# EasyEDA Pro project ProPrj_FOC_AT32F413.epro, schematic schematic1_2

## Sheets
1 CORE: Create Date: 2023-11-03; Page Name: CORE; Project Name: 基于AT32F413 的FOC驱动器; Schematic Name: Schematic1_2; Update Date: 2023-11-04; Company: 嘉立创EDA; Page Size: A3; Version: V1.3
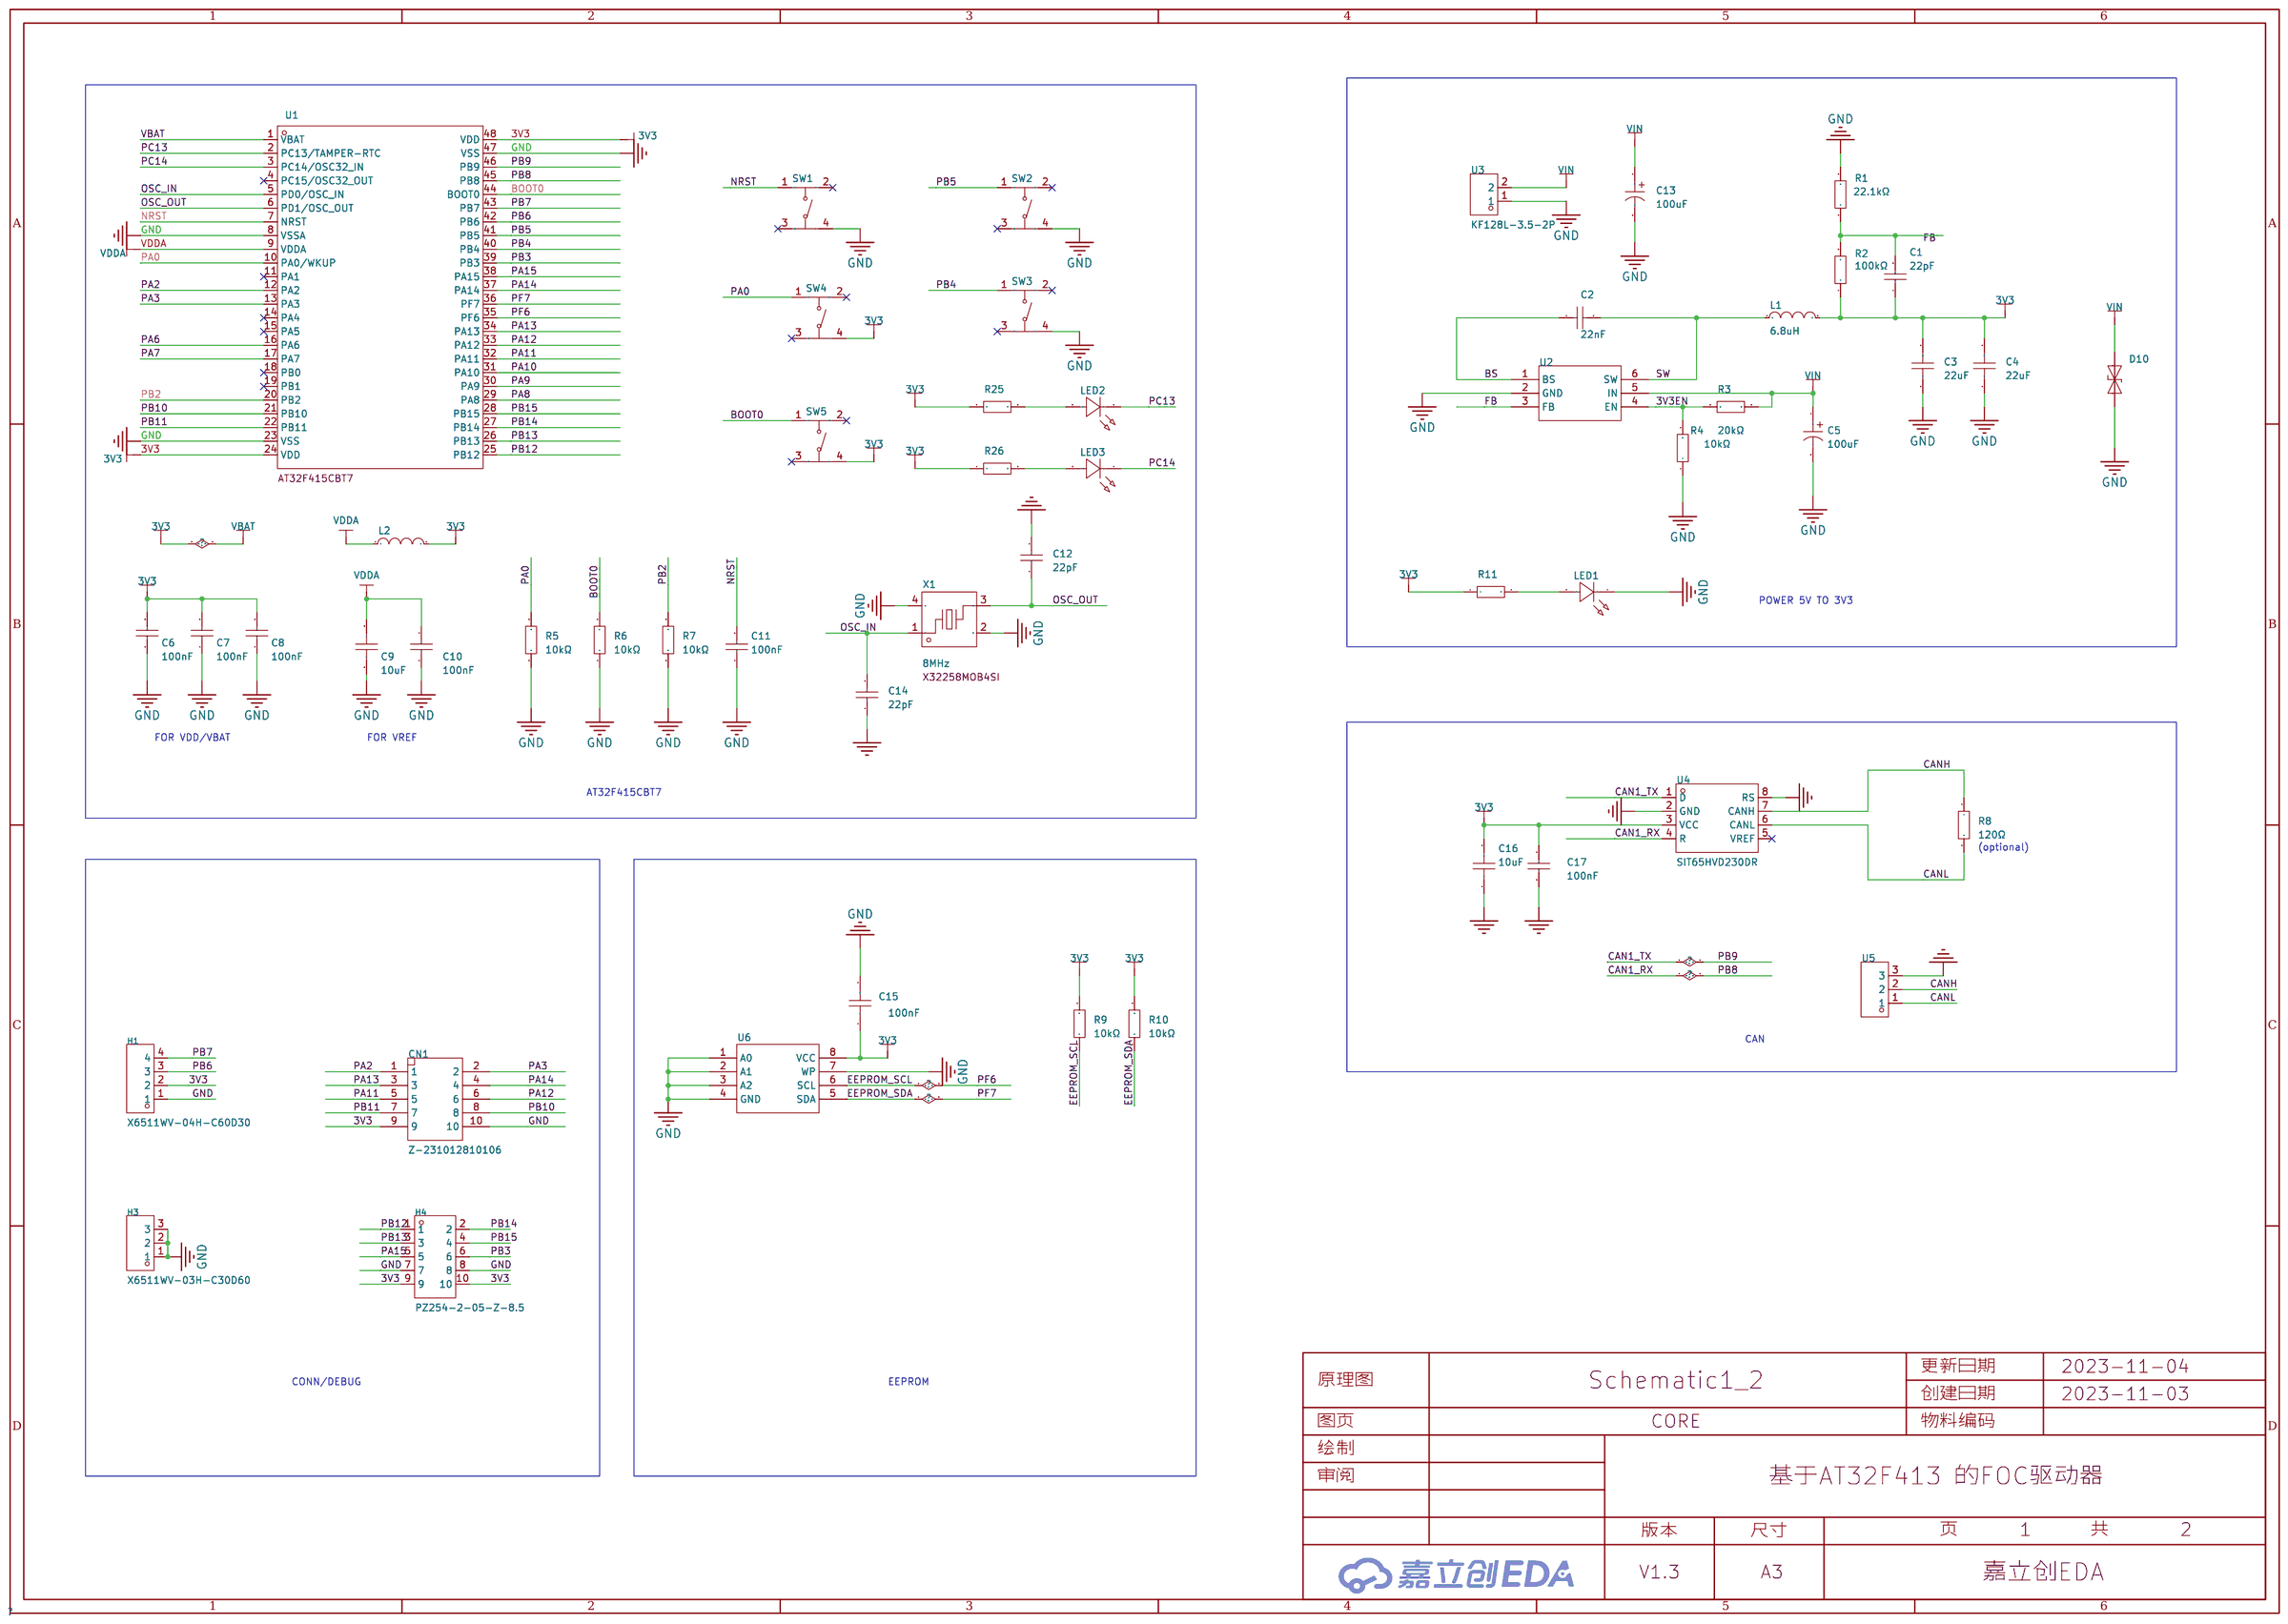
[diagram p4: CORE]
2 DRIVER: Page Name: DRIVER; Version: V1.0
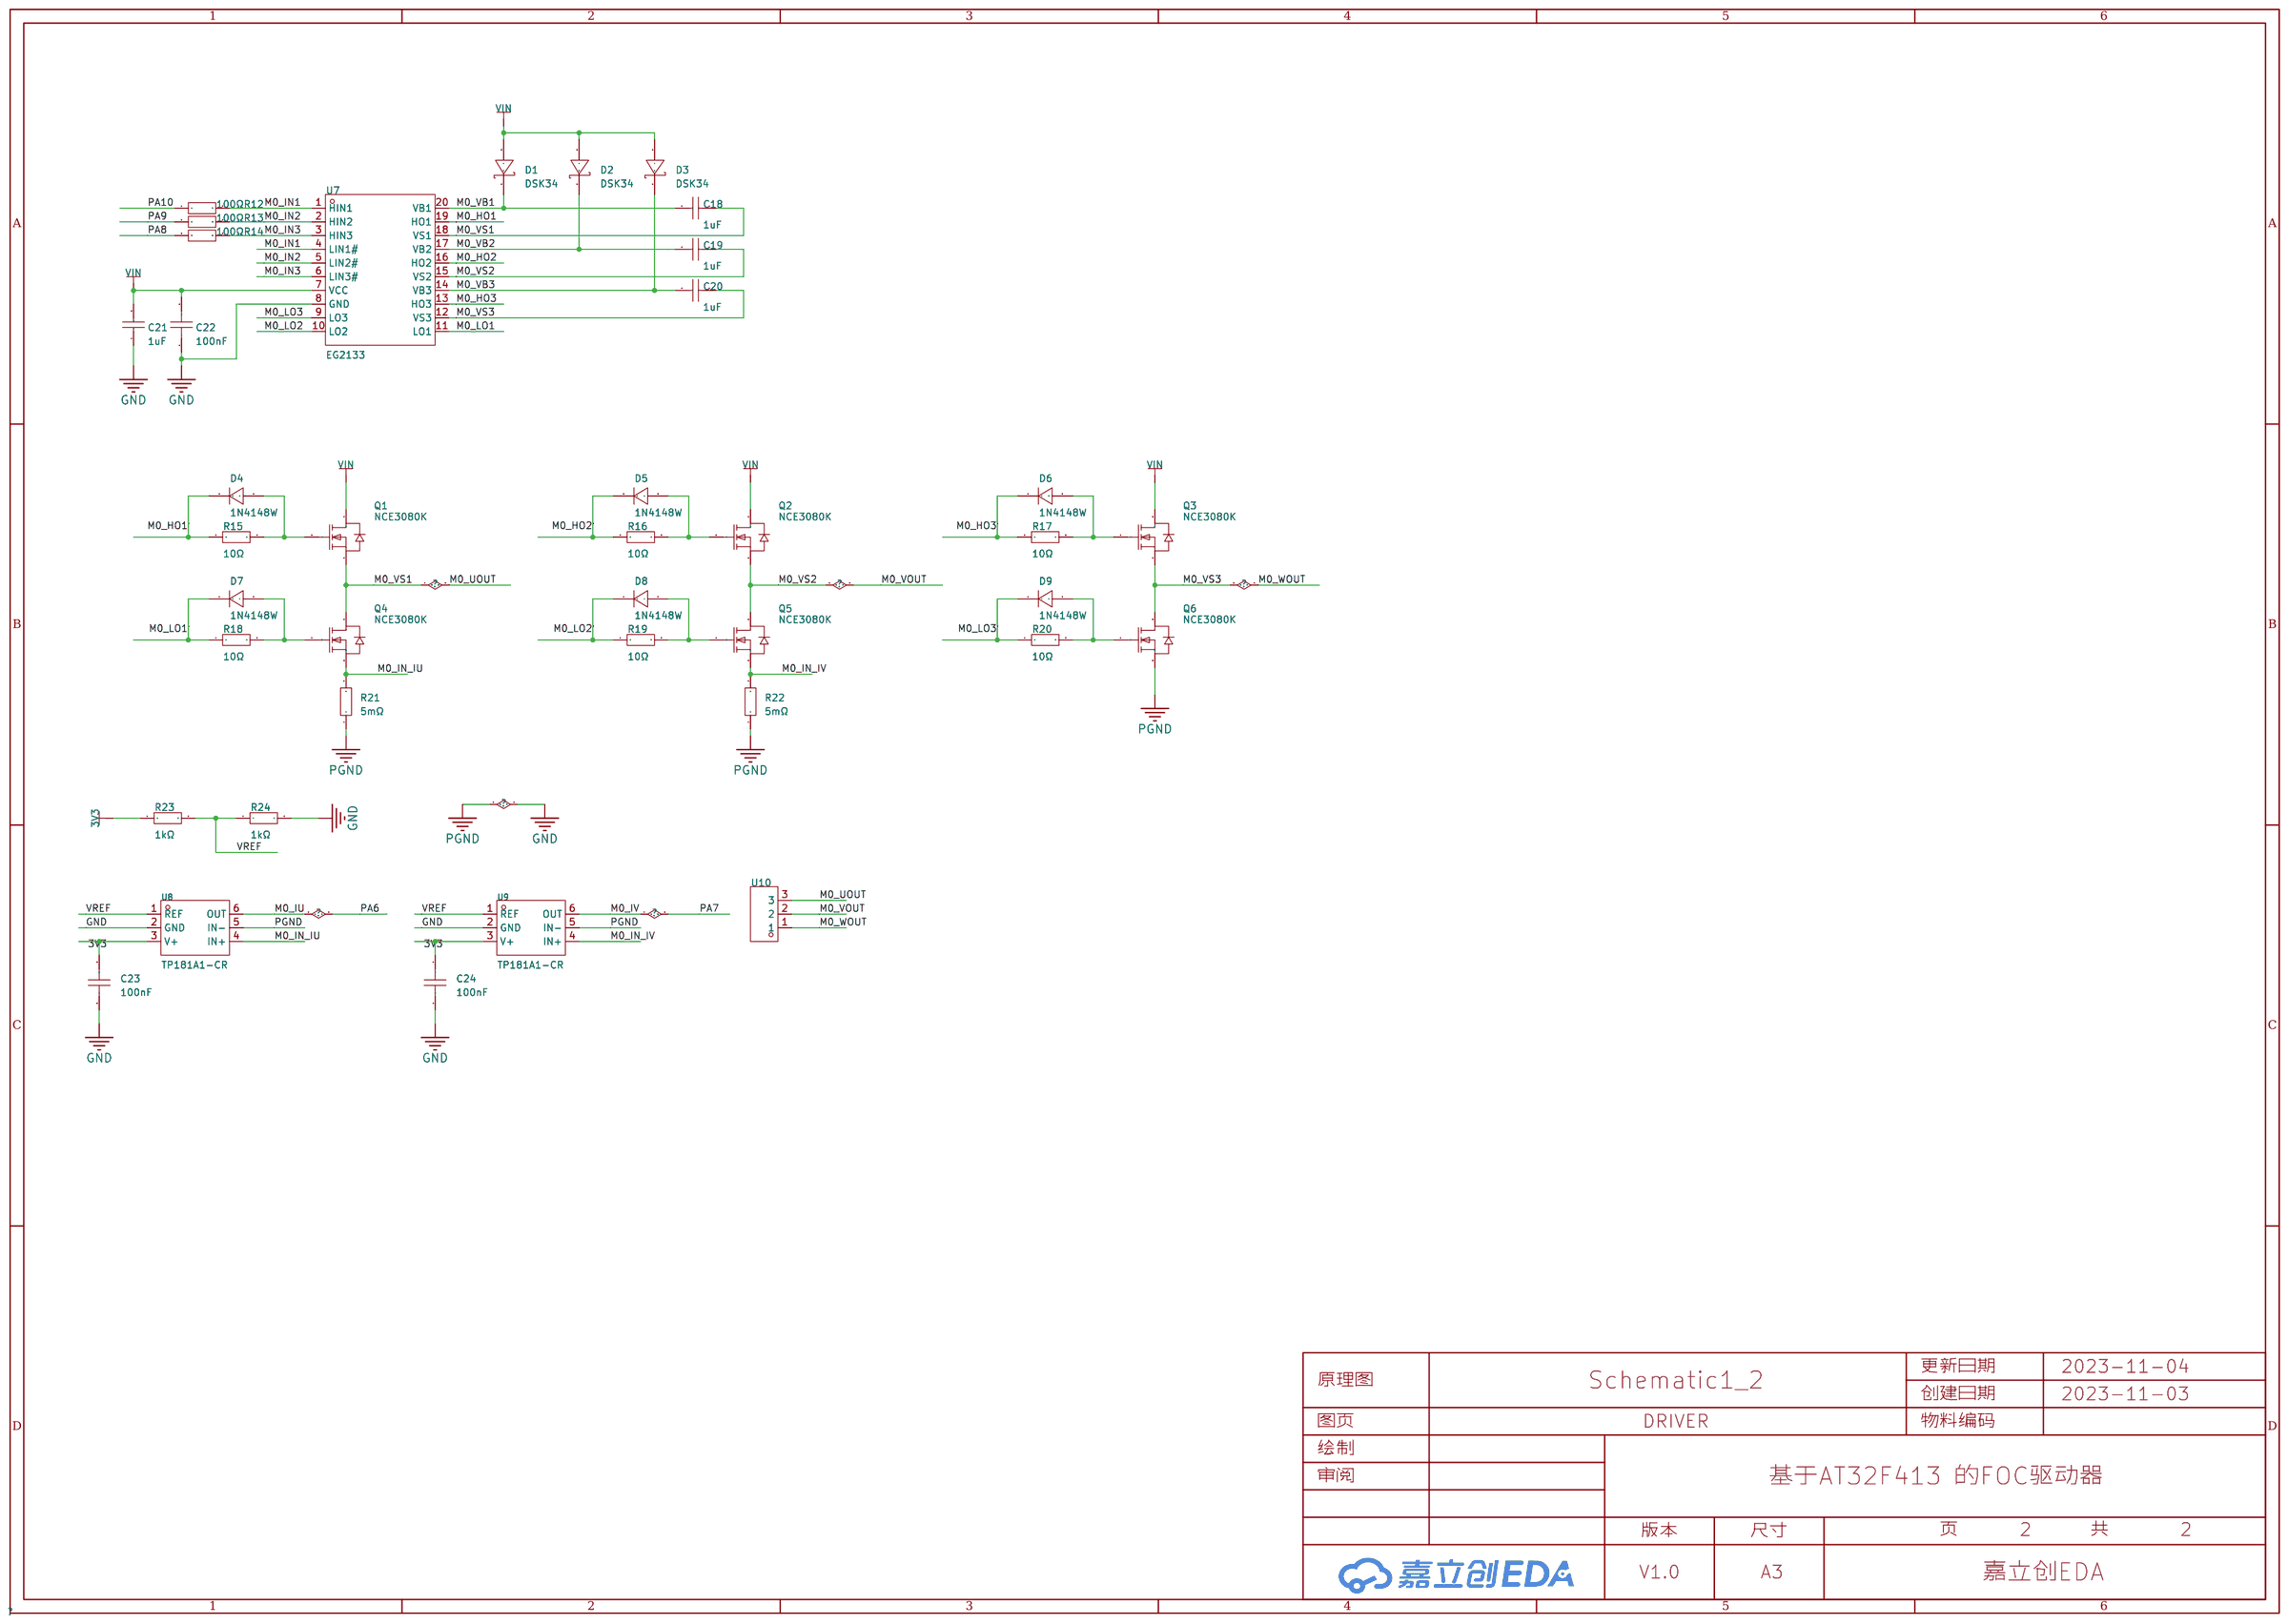
[diagram p5: DRIVER]

## Parts
sheet CORE
C1  22pF  [C0603]
C2  22nF  [C0603]
C3  22uF  [C0805]
C4  22uF  [C0805]
C5  100uF  [CAP-SMD_BD6.3-L6.6-W6.6-LS7.2-FD]
C6  100nF  [C0603]
C7  100nF  [C0603]
C8  100nF  [C0603]
C9  10uF  [C0603]
C10  100nF  [C0603]
C11  100nF  [C0603]
C12  22pF  [C0603]
C13  100uF  [CAP-SMD_BD6.3-L6.6-W6.6-LS7.2-FD]
C14  22pF  [C0603]
C15  100nF  [C0603]
C16  10uF  [C0603]
C17  100nF  [C0603]
CN1  Z-231012810106  [IDC-TH_Z-231012810106]
D10  SMAJ12CA/TR13  [SMA_L4.4-W2.6-LS5.0-BI]
H1  X6511WV-04H-C60D30  [HDR-TH_4P-P2.54-V-M]
H3  X6511WV-03H-C30D60  [HDR-TH_3P-P2.54-V-M]
H4  PZ254-2-05-Z-8.5  [HDR-TH_10P-P2.54-V-M-R2-C5-S2.54]
L1  6.8uH  [IND-SMD_L7.1-W6.6]
L2  3.3uH  [L0603]
LED1  XL-1608UBC-04  [LED0603-RD_BLUE]
LED2  XL-1608UBC-04  [LED0603-RD_BLUE]
LED3  XL-1608UBC-04  [LED0603-RD_BLUE]
R1  22.1kΩ  [R0603]
R2  100kΩ  [R0603]
R3  20kΩ  [R0603]
R4  10kΩ  [R0603]
R5  10kΩ  [R0603]
R6  10kΩ  [R0603]
R7  10kΩ  [R0603]
R8  120Ω  [R0603]
R9  10kΩ  [R0603]
R10  10kΩ  [R0603]
R11  5.1kΩ  [R0603]
R25  5.1kΩ  [R0603]
R26  5.1kΩ  [R0603]
SW1  TS-1145A-B-A  [SW-SMD_4P-L4.2-W3.2-P2.15-LS5.2]
SW2  TS-1145A-B-A  [SW-SMD_4P-L4.2-W3.2-P2.15-LS5.2]
SW3  TS-1145A-B-A  [SW-SMD_4P-L4.2-W3.2-P2.15-LS5.2]
SW4  TS-1145A-B-A  [SW-SMD_4P-L4.2-W3.2-P2.15-LS5.2]
SW5  TS-1145A-B-A  [SW-SMD_4P-L4.2-W3.2-P2.15-LS5.2]
U1  AT32F415CBT7  [LQFP-48_L7.0-W7.0-P0.50-LS9.0-BL]
U2  MT2492  [SOT-23-6_L2.9-W1.6-P0.95-LS2.8-BL]
U3  KF128L-3.5-2P  [CONN-TH_P3.50_KF128L-3.5-2P]
U4  SIT65HVD230DR  [SOP-8_L4.9-W3.9-P1.27-LS6.0-BL]
U5  KF128L-3.5-3P  [CONN-TH_3P-P3.50_KF128L-3.5-3P]
U6  AT24C02C-SSHM-T  [SOIC-8_L5.0-W4.0-P1.27-LS6.0-BL]
X1  8MHz  [OSC-SMD_4P-L3.2-W2.5-BL]
sheet DRIVER
C18  1uF  [C0603]
C19  1uF  [C0603]
C20  1uF  [C0603]
C21  1uF  [C0603]
C22  100nF  [C0603]
C23  100nF  [C0603]
C24  100nF  [C0603]
D1  DSK34  [SOD-123_L2.8-W1.8-LS3.7-RD]
D2  DSK34  [SOD-123_L2.8-W1.8-LS3.7-RD]
D3  DSK34  [SOD-123_L2.8-W1.8-LS3.7-RD]
D4  1N4148W  [SOD-123F_L2.7-W1.6-LS3.8-RD]
D5  1N4148W  [SOD-123F_L2.7-W1.6-LS3.8-RD]
D6  1N4148W  [SOD-123F_L2.7-W1.6-LS3.8-RD]
D7  1N4148W  [SOD-123F_L2.7-W1.6-LS3.8-RD]
D8  1N4148W  [SOD-123F_L2.7-W1.6-LS3.8-RD]
D9  1N4148W  [SOD-123F_L2.7-W1.6-LS3.8-RD]
Q1  NCE3080K  [TO-252-2_L6.6-W6.1-P4.57-LS9.9-TL-CW]
Q2  NCE3080K  [TO-252-2_L6.6-W6.1-P4.57-LS9.9-TL-CW]
Q3  NCE3080K  [TO-252-2_L6.6-W6.1-P4.57-LS9.9-TL-CW]
Q4  NCE3080K  [TO-252-2_L6.6-W6.1-P4.57-LS9.9-TL-CW]
Q5  NCE3080K  [TO-252-2_L6.6-W6.1-P4.57-LS9.9-TL-CW]
Q6  NCE3080K  [TO-252-2_L6.6-W6.1-P4.57-LS9.9-TL-CW]
R12  100Ω  [R0603]
R13  100Ω  [R0603]
R14  100Ω  [R0603]
R15  10Ω  [R0805_NEW]
R16  10Ω  [R0805_NEW]
R17  10Ω  [R0805_NEW]
R18  10Ω  [R0805_NEW]
R19  10Ω  [R0805_NEW]
R20  10Ω  [R0805_NEW]
R21  5mΩ  [RES-SMD_L6.4-W3.2-1]
R22  5mΩ  [RES-SMD_L6.4-W3.2-1]
R23  1kΩ  [R0603]
R24  1kΩ  [R0603]
U7  EG2133  [TSSOP-20_L6.5-W4.4-P0.65-LS6.4-BL]
U8  TP181A1-CR  [SC70-6_L2.1-W1.3-P0.65-LS2.3-BL]
U9  TP181A1-CR  [SC70-6_L2.1-W1.3-P0.65-LS2.3-BL]
U10  KF128L-3.5-3P  [CONN-TH_3P-P3.50_KF128L-3.5-3P]

## Library data of the parts
C1 C12 C14 = CL10C220JB8NNNC: 容值:22pF;精度:±5%;额定电压:50V;材质(温度系数):C0G;; LCSC Part Name: 22pF ±5% 50V; Supplier Part: C1653; Manufacturer: SAMSUNG(三星); Supplier Footprint: 0603; JLCPCB Part Class: Basic Part; Datasheet: https://atta.szlcsc.com/upload/public/pdf/source/20160103/1457707687317.pdf; Supplier: LCSC; Tolerance: ±5%; Voltage Rated: 50V; Temperature Coefficient: C0G
C2 = CL10B223KB8NNNC: 容值:22nF;精度:±10%;额定电压:50V;材质(温度系数):X7R;; LCSC Part Name: 22nF ±10% 50V; Supplier Part: C21122; Manufacturer: SAMSUNG(三星); Supplier Footprint: 0603; JLCPCB Part Class: Basic Part; Datasheet: https://atta.szlcsc.com/upload/public/pdf/source/20160103/1457707705232.pdf; Supplier: LCSC; Tolerance: ±10%; Voltage Rated: 50V; Temperature Coefficient: X7R
C3 C4 = CL21A226MAQNNNE_C45783: 容值:22uF;精度:±20%;额定电压:25V;材质(温度系数):X5R;; LCSC Part Name: 22uF ±20% 25V; Supplier Part: C45783; Manufacturer: SAMSUNG(三星); Manufacturer Part: CL21A226MAQNNNE; Supplier Footprint: 0805; JLCPCB Part Class: 基础库; Datasheet: https://atta.szlcsc.com/upload/public/pdf/source/20160103/1457707727161.pdf; Supplier: LCSC; Tolerance: ±20%; Voltage Rated: 25V; Temperature Coefficient: X5R
C5 C13 = PM101M025E077PTR: 容值:100uF;精度:±20%;额定电压:25V;; LCSC Part Name: 100uF ±20% 25V; Supplier Part: C2858382; Manufacturer: CapXon(丰宾); Supplier Footprint: SMD,6.3x7.7mm; JLCPCB Part Class: 扩展库; Datasheet: https://atta.szlcsc.com/upload/public/pdf/source/20210804/C2858382_57ECED37ED638FF3D71FBD68EF7F0C39.pdf; Supplier: LCSC; Tolerance: ±20%; Rated Voltage: 25V
C6-C8 C10 C11 C17 = 0603B104K500NT: 容值:100nF;精度:±10%;额定电压:50V;材质(温度系数):X7R;; LCSC Part Name: 100nF ±10% 50V; Supplier Part: C30926; Manufacturer: FH(风华); Supplier Footprint: 0603; JLCPCB Part Class: Extended Part; Datasheet: https://atta.szlcsc.com/upload/public/pdf/source/20170923/C30926_1506149436298988724.pdf; Supplier: LCSC; Tolerance: ±10%; Voltage Rated: 50V; Temperature Coefficient: X7R
C9 C16 = CL10A106KP8NNNC: 容值:10uF;精度:±10%;额定电压:10V;材质(温度系数):X5R;; LCSC Part Name: 10uF ±10% 10V; Supplier Part: C19702; Manufacturer: SAMSUNG(三星); Supplier Footprint: 0603; JLCPCB Part Class: Basic Part; Datasheet: https://atta.szlcsc.com/upload/public/pdf/source/20160103/1457707703378.pdf; Supplier: LCSC; Tolerance: ±10%; Voltage Rated: 10V; Temperature Coefficient: X5R
C15 = CC0603KRX7R9BB104: 容值:100nF;精度:±10%;额定电压:50V;材质(温度系数):X7R;; LCSC Part Name: 100nF ±10% 50V; Supplier Part: C14663; Manufacturer: YAGEO(国巨); Supplier Footprint: 0603; JLCPCB Part Class: Basic Part; Datasheet: https://atta.szlcsc.com/upload/public/pdf/source/20180910/C282072_33301C7F631E79921B82A8DAC6BCC5B3.pdf; Supplier: LCSC; Tolerance: ±10%; Voltage Rated: 50V; Temperature Coefficient: X7R
CN1 = Z-231012810106: 连接器类型:简牛座;每排PIN数:5;结构:2x5P;排数:2;间距:2.54mm;行距:2.54mm;封装形式:弯插;触头材质:黄铜;触头镀层:金;; LCSC Part Name: 每排P数:5 2x5P 排数:2 2.54mm; Supplier Part: C93705; Manufacturer: Nextron(正凌); Supplier Footprint: 弯插,P=2.54mm; JLCPCB Part Class: 扩展库; Datasheet: https://atta.szlcsc.com/upload/public/pdf/source/20170614/1497440021778.pdf; Supplier: LCSC; Connector Type: 简牛座; Pin Number in each Row: 5; Structure: 2x5P; Number of Rows: 2; Pitch: 2.54mm; Row Spacing: 2.54mm; Holder Type: 弯插; Contact Material: 黄铜; Contact Plating: 金
D10 = SMAJ12CA/TR13: 极性:双向;反向截止电压(Vrwm):12V;击穿电压(最小值):13.3V;击穿电压(最大值):14.7V;反向漏电流(Ir):1uA;峰值脉冲电流(Ipp)@10/1000s:20.1A;最大钳位电压:19.9V;; LCSC Part Name: 双向 Vrwm:12V; Supplier Part: C78399; Manufacturer: Brightking(君耀电子); Supplier Footprint: SMA(DO-214AC); JLCPCB Part Class: Extended Part; Datasheet: https://atta.szlcsc.com/upload/public/pdf/source/20160709/1468031880937.pdf; Supplier: LCSC; Polarity: 双向; Reverse Stand-Off Voltage (Vrwm): 12V; Breakdown Voltage (Min): 13.3V; Breakdown Voltage (Max): 14.7V; Reverse Leakage Current (Ir): 1uA; Peak Pulse Current (Ipp)@10/1000μs: 20.1A; Maximum Clamping Voltage: 19.9V
H1 = X6511WV-04H-C60D30: 排数:单排;总PIN位数:4P;间距:2.54mm;插针结构:1x4P;行距:-;安装类型:直插;圆针/方针:方针;额定电流:3A;额定电压:250V;配合针长度:6mm;塑高:2.5mm;端接针长度:3mm;触头材质:黄铜;触头镀层:金;工作温度范围:-40℃~+105℃;焊接温度(最大值):260℃;颜色:黑色;; LCSC Part Name: 2.54mm 1x4P 直插 方针 镀金足1U; Supplier Part: C706876; Manufacturer: XKB Connectivity(中国星坤); Supplier Footprint: 插件,P=2.54mm; JLCPCB Part Class: 扩展库; Datasheet: https://atta.szlcsc.com/upload/public/pdf/source/20211009/D19569EFFEB9776B42364DF7D41FD96A.pdf; Supplier: LCSC; Number of Rows: 单排; Number of Pins: 4P; Pitch: 2.54mm; Pin Structure: 1x4P; Mounting Type: 直插; Circluar Pins/Square Pins: 方针; Current Rating (Max): 3A; Voltage Rating (Max): 250V; Length of Mating Pin: 6mm; Insulation Height: 2.5mm; Length of End Connection Pin: 3mm; Contact Material: 黄铜; Contact Plating: 金; Operating Temperature Range: -40℃~+105℃; Welding Temperature (Max): 260℃; Color: 黑色
H3 = X6511WV-03H-C30D60: 排数:单排;总PIN位数:3;间距:2.54mm;插针结构:1x3P;行距:-;安装类型:直插;圆针/方针:方针;额定电流:3A;额定电压:250V;配合针长度:6mm;塑高:2.5mm;端接针长度:3mm;触头材质:黄铜;触头镀层:金;工作温度范围:-40℃~+105℃;焊接温度(最大值):260℃;颜色:黑色;; LCSC Part Name: 2.54mm 1x3P 直插 方针; Supplier Part: C706875; Manufacturer: XKB Connectivity(中国星坤); Supplier Footprint: 插件,P=2.54mm; JLCPCB Part Class: Extended Part; Supplier: LCSC; Number of Rows: 单排; Number of Pins: 3; Pitch: 2.54mm; Pin Structure: 1x3P; Mounting Type: 直插; Circluar Pins/Square Pins: 方针; Current Rating (Max): 3A; Voltage Rating (Max): 250V; Length of Mating Pin: 6mm; Insulation Height: 2.5mm; Length of End Connection Pin: 3mm; Contact Material: 黄铜; Contact Plating: 金; Operating Temperature Range: -40℃~+105℃; Welding Temperature (Max): 260℃; Color: 黑色
H4 = PZ254-2-05-Z-8.5_C2894966: 排数:双排;总PIN位数:10;间距:2.54mm;插针结构:2x5P;行距:2.54mm;安装类型:直插;圆针/方针:方针;额定电流:3A;额定电压:-;配合针长度:6mm;塑高:2.5mm;端接针长度:3mm;触头材质:-;工作温度范围:-40℃~+105℃;颜色:黑色;; LCSC Part Name: 2.54mm 2x5P 直插 方针; Supplier Part: C2894966; Manufacturer: HCTL(华灿天禄); Supplier Footprint: 直插,P=2.54mm; JLCPCB Part Class: Extended Part; Supplier: LCSC; Number of Rows: 双排; Number of Pins: 10; Pitch: 2.54mm; Pin Structure: 2x5P; Row Spacing: 2.54mm; Mounting Type: 直插; Circluar Pins/Square Pins: 方针; Current Rating (Max): 3A; Length of Mating Pin: 6mm; Insulation Height: 2.5mm; Length of End Connection Pin: 3mm; Operating Temperature Range: -40℃~+105℃; Color: 黑色
L1 = 0630 6.8uH: Check: false
L2 = CMH160808B3R3MT: 电感值:3.3uH;精度:±20%;额定电流:-;直流电阻(DCR):-;; LCSC Part Name: 3.3uH ±20%; Supplier Part: C394951; Manufacturer: FH(风华); Supplier Footprint: 0603; JLCPCB Part Class: Extended Part; Datasheet: https://atta.szlcsc.com/upload/public/pdf/source/20190710/C394951_71BAFAF5AD49A9E7B15767971135924D.pdf; Supplier: LCSC; Tolerance: ±20%
LED1-LED3 = XL-1608UBC-04: 发光颜色:蓝灯;透镜颜色:无色透明;主波长:460nm~469nm;峰值波长:475nm;色温:-;光通量(25时):-;测试电流:25mA;正向电压(VF):2.9V;发光强度:60mcd;功率:80mW;发光角度:120°;安装方式:正贴;工作温度:-30~+85;; LCSC Part Name: 蓝灯 正贴; Supplier Part: C965807; Manufacturer: XINGLIGHT(成兴光); Supplier Footprint: 0603; JLCPCB Part Class: Extended Part; Datasheet: https://atta.szlcsc.com/upload/public/pdf/source/20201230/C965807_0B1866580FA037C0283EE42D08A2BF0F.pdf; Supplier: LCSC; Emitted Color: 蓝灯; Lens Color: 无色透明; Dominant Wavelength: 460nm~469nm; Peak Wavelength: 475nm; Forward Current: 25mA; Forward Voltage (VF): 2.9V; Luminous Intensity: 60mcd; Power Dissipation: 80mW; Viewing Angle: 120°; Mounting Sytle: 正贴; Operating Temperature: -30~+85
R1 = 0603WAF2212T5E: 电阻类型:厚膜电阻;阻值:22.1kΩ;精度:±1%;功率:100mW;; LCSC Part Name: 22.1kΩ ±1% 100mW; Supplier Part: C25961; Manufacturer: UNI-ROYAL(厚声); Supplier Footprint: 0603; JLCPCB Part Class: Extended Part; Datasheet: https://atta.szlcsc.com/upload/public/pdf/source/20200306/C422600_1E6D84923E4A46A82E41ADD87F860B5C.pdf; Supplier: LCSC; Temperature Coefficient: ±100ppm/℃; Operating Temperature Range: -55℃~+155℃; Type: 厚膜电阻; Tolerance: ±1%; Power(Watts): 100mW; Overload Voltage (Max): 75V
R2 = 0603WAF1003T5E: 电阻类型:厚膜电阻;阻值:100kΩ;精度:±1%;功率:100mW;温度系数:±100ppm/℃;最大工作电压:75V;工作温度范围:-55℃~+155℃;; LCSC Part Name: 100kΩ ±1% 100mW; Supplier Part: C25803; Manufacturer: UNI-ROYAL(厚声); Supplier Footprint: 0603; JLCPCB Part Class: Basic Part; Datasheet: https://atta.szlcsc.com/upload/public/pdf/source/20200306/C422600_1E6D84923E4A46A82E41ADD87F860B5C.pdf; Supplier: LCSC; Type: 厚膜电阻; Tolerance: ±1%; Power(Watts): 100mW; Temperature Coefficient: ±100ppm/℃; Overload Voltage (Max): 75V; Operating Temperature Range: -55℃~+155℃
R3 = 0603WAF2002T5E: 电阻类型:厚膜电阻;阻值:20kΩ;精度:±1%;功率:100mW;温度系数:±100ppm/℃;最大工作电压:75V;工作温度范围:-55℃~+155℃;; LCSC Part Name: 20kΩ ±1% 100mW; Supplier Part: C4184; Manufacturer: UNI-ROYAL(厚声); Supplier Footprint: 0603; JLCPCB Part Class: Basic Part; Datasheet: https://atta.szlcsc.com/upload/public/pdf/source/20200306/C422600_1E6D84923E4A46A82E41ADD87F860B5C.pdf; Supplier: LCSC; Type: 厚膜电阻; Tolerance: ±1%; Power(Watts): 100mW; Temperature Coefficient: ±100ppm/℃; Overload Voltage (Max): 75V; Operating Temperature Range: -55℃~+155℃
R4 = 0603WAF1002T5E: 电阻类型:厚膜电阻;阻值:10kΩ;精度:±1%;功率:100mW;温度系数:±100ppm/℃;最大工作电压:75V;工作温度范围:-55℃~+155℃;; LCSC Part Name: 10kΩ ±1% 100mW; Supplier Part: C25804; Manufacturer: UNI-ROYAL(厚声); Supplier Footprint: 0603; JLCPCB Part Class: Basic Part; Datasheet: https://atta.szlcsc.com/upload/public/pdf/source/20200306/C422600_1E6D84923E4A46A82E41ADD87F860B5C.pdf; Supplier: LCSC; Type: 厚膜电阻; Tolerance: ±1%; Power(Watts): 100mW; Temperature Coefficient: ±100ppm/℃; Overload Voltage (Max): 75V; Operating Temperature Range: -55℃~+155℃
R5-R7 R9 R10 = 0603WAF1002T5E: 电阻类型:厚膜电阻;阻值:10kΩ;精度:±1%;功率:100mW;; LCSC Part Name: 厚膜电阻 10kΩ ±1% 100mW; Supplier Part: C25804; Manufacturer: UNI-ROYAL(厚声); Supplier Footprint: 0603; JLCPCB Part Class: Basic Part; Datasheet: https://atta.szlcsc.com/upload/public/pdf/source/20200306/C422600_1E6D84923E4A46A82E41ADD87F860B5C.pdf; Supplier: LCSC; Type: 厚膜电阻; Tolerance: ±1%; Power(Watts): 100mW; Temperature Coefficient: ±100ppm/℃; Overload Voltage (Max): 75V; Operating Temperature Range: -55℃~+155℃
R8 = 0603WAF1200T5E: 电阻类型:厚膜电阻;阻值:120Ω;精度:±1%;功率:100mW;; LCSC Part Name: 120Ω ±1% 100mW; Supplier Part: C22787; Manufacturer: UNI-ROYAL(厚声); Supplier Footprint: 0603; JLCPCB Part Class: Basic Part; Datasheet: https://atta.szlcsc.com/upload/public/pdf/source/20200306/C422600_1E6D84923E4A46A82E41ADD87F860B5C.pdf; Supplier: LCSC; Type: 厚膜电阻; Tolerance: ±1%; Power(Watts): 100mW; Temperature Coefficient: ±100ppm/℃; Overload Voltage (Max): 75V; Operating Temperature Range: -55℃~+155℃
R11 R25 R26 = 0603WAF5101T5E: 电阻类型:厚膜电阻;阻值:5.1kΩ;精度:±1%;功率:100mW;温度系数:±100ppm/℃;; LCSC Part Name: 厚膜电阻 5.1kΩ ±1% 100mW; Supplier Part: C23186; Manufacturer: UNI-ROYAL(厚声); Supplier Footprint: 0603; JLCPCB Part Class: Basic Part; Datasheet: https://atta.szlcsc.com/upload/public/pdf/source/20200306/C422600_1E6D84923E4A46A82E41ADD87F860B5C.pdf; Supplier: LCSC; Type: 厚膜电阻; Tolerance: ±1%; Power(Watts): 100mW; Temperature Coefficient: ±100ppm/℃; Overload Voltage (Max): 75V; Operating Temperature Range: -55℃~+155℃
SW1-SW5 = TS-1145A-B-A: 触点电流:50mA;额定电压(DC):12V;绝缘电阻:100mΩ;电路结构:单刀单掷;安装方式:立贴;按钮形状:椭圆形按钮;按钮/盖帽颜色:白色;带灯:无;作用力:260gf;机械寿命:100000;工作温度:-30~+85;开关长度:4.2mm;开关宽度:3.2mm;开关高度:2.5mm;带支架:否;; LCSC Part Name: 3.2X4.2X2.5平脚160gf白色按钮; Supplier Part: C318904; Manufacturer: XKB Connectivity(中国星坤); Supplier Footprint: SMD; JLCPCB Part Class: Extended Part; Datasheet: https://atta.szlcsc.com/upload/public/pdf/source/20211011/FC00869C3CE33BCCD344D072F551E76B.pdf; Supplier: LCSC; Contact Current: 50mA; Voltage Rating (DC): 12V; Insulation Resistance: 100mΩ; Circuit: 单刀单掷; Mounting Style: 立贴; Actuator Style: 椭圆形按钮; Actuator/Cap Color: 白色; With Lamp: 无; Operating Force: 260gf; Mechanical Life: 100000; Operating Temperature: -30~+85; Switch Length: 4.2mm; Switch Width: 3.2mm; Switch Height: 2.5mm; Strike Gundam: 否
U1 = AT32F415CBT7_C528427: CPU内核:ARM Cortex-M4;CPU最大主频:-;程序存储容量:128KB;程序存储器类型:FLASH;RAM总容量:32KB;GPIO端口数量:-;; LCSC Part Name: ARM Cortex-M4; Supplier Part: C528427; Manufacturer: ARTERY(雅特力); Supplier Footprint: LQFP-48(7x7); JLCPCB Part Class: Extended Part; Datasheet: https://atta.szlcsc.com/upload/public/pdf/source/20200507/C528425_955931935851DA1D79A558202FE2F03A.pdf; Supplier: LCSC; CPU Core: ARM Cortex-M4; Program Storage Size: 128KB; Program Memory Type: FLASH; RAM Size: 32KB
U2 = MT2492: 功能类型:降压型;同步整流:-;输出通道数:-;拓扑结构:-;输入电压:-;输出电流(最大值):-;开关频率:-;; LCSC Part Name: 降压型; Supplier Part: C89358; Manufacturer: 西安航天民芯; Supplier Footprint: SOT-23-6; JLCPCB Part Class: Extended Part; Datasheet: https://atta.szlcsc.com/upload/public/pdf/source/20221209/5C81DA9662873D3A116170FFBF63E49D.pdf; Supplier: LCSC; Function: 降压型
U3 = KF128L-3.5-2P: 间距:3.5mm;排数:1;每排PIN数:2;安装方式:直针;额定电流:10A;额定电压:300V;线规 - AWG:16~26;线规 - mm?:1;工作温度范围:-40℃~+105℃;颜色:绿色;; LCSC Part Name: 3.5mm 排数:1 每排P数:2 直针 可拼接 铜 环保; Supplier Part: C474930; Manufacturer: KEFA(科发); Supplier Footprint: 直插,P=3.5mm; JLCPCB Part Class: 扩展库; Datasheet: https://atta.szlcsc.com/upload/public/pdf/source/20200115/C474930_99E88C734F0367C4F80443B58FE9D8B8.pdf; Supplier: LCSC; Pitch: 3.5mm; Number of Rows: 1; Number of PINs Per Row: 2; Mounting Style: 直针; Current Rating (Max): 10A; Voltage Rating (Max): 300V; Wire Gauge - AWG: 16~26; Wire Gauge - mm?: 1; Operating Temperature Range: -40℃~+105℃; Color: 绿色
U4 = SIT65HVD230DR: 类型:-;; Supplier Part: C496619; Manufacturer: SIT(芯力特); Supplier Footprint: SOP-8; JLCPCB Part Class: 扩展库; Datasheet: https://atta.szlcsc.com/upload/public/pdf/source/20200313/C496619_AFEDC6182C941FC5FA6F8E58312D272B.pdf; Supplier: LCSC
U5 U10 = KF128L-3.5-3P: 间距:3.5mm;排数:1;每排PIN数:3;安装方式:直针;额定电流:10A;额定电压:300V;线规 - AWG:16~26;线规 - mm?:1;工作温度范围:-40℃~+105℃;颜色:绿色;; LCSC Part Name: 3.5mm 排数:1 每排P数:3 直针 可拼接 铜 环保; Supplier Part: C474931; Manufacturer: KEFA(科发); Supplier Footprint: 直插,P=3.5mm; JLCPCB Part Class: Extended Part; Datasheet: https://atta.szlcsc.com/upload/public/pdf/source/20200115/C474931_618B4187A34D3BB889241B98628E2E81.pdf; Supplier: LCSC; Pitch: 3.5mm; Number of Rows: 1; Number of PINs Per Row: 3; Mounting Style: 直针; Current Rating (Max): 10A; Voltage Rating (Max): 300V; Wire Gauge - AWG: 16~26; Wire Gauge - mm?: 1; Operating Temperature Range: -40℃~+105℃; Color: 绿色
U6 = AT24C02C-SSHM-T: 存储器容量:2Kb (256 x 8);存储器接口类型:I2C;工作电压:1.7V ~ 5.5V;; Supplier Part: C6203; Manufacturer: MICROCHIP(美国微芯); Supplier Footprint: SOIC-8_150mil; JLCPCB Part Class: Extended Part; Datasheet: https://atta.szlcsc.com/upload/public/pdf/source/20151231/1457707659939.pdf; Supplier: LCSC; Memory Format: EEPROM; Memory Size: 2Kb (256 x 8); Memory Interface: I2C; Voltage - Supply: 1.7V ~ 5.5V
X1 = X32258MOB4SI: 晶振类型:贴片无源晶振;频率:8MHz;频率公差:±10ppm;频率稳定度:±30ppm;负载电容:12pF;等效串联电阻(ESR):150Ω;工作温度:-40℃~+85℃;; LCSC Part Name: YSX321SL 8MHz ±10ppm 12pF; Supplier Part: C2682775; Manufacturer: YXC(扬兴晶振); Supplier Footprint: SMD3225-4P; JLCPCB Part Class: Extended Part; Datasheet: https://atta.szlcsc.com/upload/public/pdf/source/20210106/C2682774_0CD4FDA5D9DA3FBEEC23BD607A48E4B0.pdf; Supplier: LCSC; Crystal Type: 贴片无源晶振; Frequency Tolerance: ±10ppm; Frequency Stability: ±30ppm; Load Capacitance: 12pF; Equivalent Series Resistance (ESR): 150Ω; Operating Temperature: -40℃~+85℃
C18-C21 = CL10A105KB8NNNC: 容值:1uF;精度:±10%;额定电压:50V;材质(温度系数):X5R;; LCSC Part Name: 1uF ±10% 50V; Supplier Part: C15849; Manufacturer: SAMSUNG(三星); Supplier Footprint: 0603; JLCPCB Part Class: Basic Part; Datasheet: https://atta.szlcsc.com/upload/public/pdf/source/20160103/1457707679084.pdf; Supplier: LCSC; Tolerance: ±10%; Voltage Rated: 50V; Temperature Coefficient: X5R
C22-C24 = CC0603KRX7R9BB104: 容值:100nF;精度:±10%;额定电压:50V;材质(温度系数):X7R;; LCSC Part Name: 100nF ±10% 50V; Supplier Part: C14663; Manufacturer: YAGEO(国巨); Supplier Footprint: 0603; JLCPCB Part Class: 基础库; Datasheet: https://atta.szlcsc.com/upload/public/pdf/source/20180910/C282072_33301C7F631E79921B82A8DAC6BCC5B3.pdf; Supplier: LCSC; Tolerance: ±10%; Voltage Rated: 50V; Temperature Coefficient: X7R
D1-D3 = DSK34_C41029: 直流反向耐压(Vr):40V;平均整流电流(Io):3A;正向压降(Vf):550mV@3A;; LCSC Part Name: 40V 3A 550mV@3A; Supplier Part: C41029; Manufacturer: MDD; Supplier Footprint: SOD-123FL; JLCPCB Part Class: Extended Part; Datasheet: https://atta.szlcsc.com/upload/public/pdf/source/20190305/C41029_7EEC8BE9111EDCB4600664A05F84C156.pdf; Supplier: LCSC; Reverse Voltage (Vr): 40V; Average Rectified Current (Io): 3A; Forward Voltage (Vf@If): 550mV@3A
D4-D9 = 1N4148W_C81598: 二极管配置:独立式;功率:400mW;直流反向耐压(Vr):75V;平均整流电流(Io):150mA;正向压降(Vf):1V@50mA;反向恢复时间(trr):4ns;; LCSC Part Name: 75V 150mA 4ns; Supplier Part: C81598; Manufacturer: ST(先科); Supplier Footprint: SOD-123; JLCPCB Part Class: 基础库; Datasheet: https://atta.szlcsc.com/upload/public/pdf/source/20161024/1477288446905.pdf; Supplier: LCSC; Diode Configuration: 独立式; Power Dissipation: 400mW; Reverse Voltage (Vr): 75V; Average Rectified Current (Io): 150mA; Forward Voltage (Vf@If): 1V@50mA; Reverse Leakage Current: 1uA@75V; Reverse Recovery Time (trr): 4ns; Operating Temperature: +150℃@(Tj)
Q1-Q6 = NCE3080K: 类型:N沟道;漏源电压(Vdss):30V;连续漏极电流(Id):80A;功率(Pd):83W;导通电阻(RDS(on)@Vgs,Id):6.5mΩ@10V,30A;阈值电压(Vgs(th)@Id):3V@250uA;; LCSC Part Name: N沟道 30V 80A; Supplier Part: C108901; Manufacturer: NCE(无锡新洁能); Supplier Footprint: TO-252-2(DPAK); JLCPCB Part Class: 扩展库; Datasheet: https://atta.szlcsc.com/upload/public/pdf/source/20170505/1493957853878.pdf; Supplier: LCSC; Type: N沟道; Drain Source Voltage (Vdss): 30V; Continuous Drain Current (Id): 80A; Power Dissipation (Pd): 83W; Drain Source On Resistance (RDS(on)@Vgs,Id): 6.5mΩ@10V,30A; Gate Threshold Voltage (Vgs(th)@Id): 3V@250uA
R12-R14 = 0603WAF1000T5E: 电阻类型:厚膜电阻;阻值:100Ω;精度:±1%;功率:100mW;; LCSC Part Name: 100Ω ±1% 100mW; Supplier Part: C22775; Manufacturer: UNI-ROYAL(厚声); Supplier Footprint: 0603; JLCPCB Part Class: Basic Part; Datasheet: https://atta.szlcsc.com/upload/public/pdf/source/20200306/C422600_1E6D84923E4A46A82E41ADD87F860B5C.pdf; Supplier: LCSC; Type: 厚膜电阻; Tolerance: ±1%; Power(Watts): 100mW; Temperature Coefficient: ±200ppm/℃; Overload Voltage (Max): 75V; Operating Temperature Range: -55℃~+155℃
R15-R20 = 0805W8F100JT5E: 电阻类型:厚膜电阻;阻值:10Ω;精度:±1%;功率:125mW;; LCSC Part Name: 10Ω ±1% 125mW; Supplier Part: C17415; Manufacturer: UNI-ROYAL(厚声); Supplier Footprint: 0805; JLCPCB Part Class: 基础库; Datasheet: https://atta.szlcsc.com/upload/public/pdf/source/20200306/C422600_1E6D84923E4A46A82E41ADD87F860B5C.pdf; Supplier: LCSC; Type: 厚膜电阻; Tolerance: ±1%; Power(Watts): 125mW; Temperature Coefficient: ±200ppm/℃; Overload Voltage (Max): 150V; Operating Temperature Range: -55℃~+155℃
R21 R22 = RLP25FEER005: 阻值:5mΩ;精度:±1%;功率:2W;; LCSC Part Name: 5mΩ ±1% 2W; Supplier Part: C316228; Manufacturer: 大毅科技; Supplier Footprint: 2512; JLCPCB Part Class: 扩展库; Datasheet: https://atta.szlcsc.com/upload/public/pdf/source/20181023/C316228_66D2B2FCD28B27A9DF31AD578F0629CF.pdf; Supplier: LCSC; Tolerance: ±1%; Power(Watts): 2W; Temperature Coefficient: ±50ppm/℃
R23 R24 = 0603WAF1001T5E: 电阻类型:厚膜电阻;阻值:1kΩ;精度:±1%;功率:100mW;温度系数:±100ppm/℃;; LCSC Part Name: 厚膜电阻 1kΩ ±1% 100mW; Supplier Part: C21190; Manufacturer: UNI-ROYAL(厚声); Supplier Footprint: 0603; JLCPCB Part Class: 基础库; Datasheet: https://atta.szlcsc.com/upload/public/pdf/source/20200306/C422600_1E6D84923E4A46A82E41ADD87F860B5C.pdf; Supplier: LCSC; Type: 厚膜电阻; Tolerance: ±1%; Power(Watts): 100mW; Temperature Coefficient: ±100ppm/℃; Overload Voltage (Max): 75V; Operating Temperature Range: -55℃~+155℃
U7 = EG2133_C190343: EG2133是一款高性价比的三相半桥驱动芯片，配合六颗Nmos可以组成三相直流无刷电机驱动器。; Supplier Part: C190343; Manufacturer: EG(屹晶微); Supplier Footprint: TSSOP-20; JLCPCB Part Class: 扩展库; Datasheet: https://atta.szlcsc.com/upload/public/pdf/source/20220627/F8A393EEBF3325F22DCB485BC683267F.pdf; Supplier: LCSC
U8 U9 = TP181A1-CR: Supplier Part: C2902349; Manufacturer: 3PEAK; Supplier Footprint: SC70-6; JLCPCB Part Class: 扩展库; Datasheet: https://atta.szlcsc.com/upload/public/pdf/source/20230301/6D62DABF8769A8088870FFE026FF2C6D.pdf; Supplier: LCSC

## Nets
3V3: C1.1 C3.2 C4.2 C6.2 C7.2 C8.2 C15.1 C16.2 C17.2 C23.1 C24.1 CN1.9 H1.2 H4.9 H4.10 L1.2 L2.2 R2.1 R9.2 R10.2 R11.1 R23.1 R25.1 R26.1 SW4.4 SW5.4 U1.1(VBAT) U1.24(VDD) U1.48(VDD) U4.3(VCC) U6.8(VCC) U8.3(V+) U9.3(V+)
3V3EN: R3.1 R4.2 U2.4(EN)
GND: C3.1 C4.1 C5.2 C6.1 C7.1 C8.1 C9.1 C10.1 C11.1 C12.2 C13.2 C14.1 C15.2 C16.1 C17.1 C21.1 C22.1 C23.2 C24.2 CN1.10 D10.1 H1.1 H3.1 H3.2 H3.3 H4.7 H4.8 LED1.1(K) Q6.3(S) R1.2 R4.1 R5.1 R6.1 R7.1 R21.1 R22.1 R24.2 SW1.4 SW2.4 SW3.4 U1.8(VSSA) U1.23(VSS) U1.47(VSS) U2.2(GND) U3.1 U4.2(GND) U4.8(RS) U5.3 U6.1(A0) U6.2(A1) U6.3(A2) U6.4(GND) U6.7(WP) U7.8(GND) U8.2(GND) U8.5(IN-) U9.2(GND) U9.5(IN-) X1.2(GND) X1.4(GND)
VDDA: C9.2 C10.2 L2.1 U1.9(VDDA)
VIN: C5.1 C13.1 C21.2 C22.2 D1.2(A) D2.2(A) D3.2(A) D10.2 Q1.2(D) Q2.2(D) Q3.2(D) R3.2 U2.5(IN) U3.2 U7.7(VCC)
BOOT0: R6.2 SW5.1 U1.44(BOOT0)
BS: C2.1 U2.1(BS)
CAN1_RX: U1.45(PB8) U4.4(R)
CAN1_TX: U1.46(PB9) U4.1(D)
CANH: R8.1 U4.7(CANH) U5.2
CANL: R8.2 U4.6(CANL) U5.1
EEPROM_SCL: R9.1 U1.35(PF6) U6.6(SCL)
EEPROM_SDA: R10.1 U1.36(PF7) U6.5(SDA)
FB: C1.2 R1.1 R2.2 U2.3(FB)
M0_HO1: D4.1(K) R15.1 U7.19(HO1)
M0_HO2: D5.1(K) R16.1 U7.16(HO2)
M0_HO3: D6.1(K) R17.1 U7.13(HO3)
M0_IN1: R12.2 U7.1(HIN1) U7.4(LIN1#)
M0_IN2: R13.2 U7.2(HIN2) U7.5(LIN2#)
M0_IN3: R14.2 U7.3(HIN3) U7.6(LIN3#)
M0_IN_IU: Q4.3(S) R21.2 U8.4(IN+)
M0_IN_IV: Q5.3(S) R22.2 U9.4(IN+)
M0_IU: U1.16(PA6) U8.6(OUT)
M0_IV: U1.17(PA7) U9.6(OUT)
M0_LO1: D7.1(K) R18.1 U7.11(LO1)
M0_LO2: D8.1(K) R19.1 U7.10(LO2)
M0_LO3: D9.1(K) R20.1 U7.9(LO3)
M0_UOUT: C18.1 Q1.3(S) Q4.2(D) U7.18(VS1) U10.3
M0_VB1: C18.2 D1.1(K) U7.20(VB1)
M0_VB2: C19.2 D2.1(K) U7.17(VB2)
M0_VB3: C20.2 D3.1(K) U7.14(VB3)
M0_VOUT: C19.1 Q2.3(S) Q5.2(D) U7.15(VS2) U10.2
M0_VS3: C20.1 Q3.3(S) Q6.2(D) U7.12(VS3) U10.1
NRST: C11.2 SW1.1 U1.7(NRST)
OSC_IN: C14.2 U1.5(PD0/OSC_IN) X1.1
OSC_OUT: C12.1 U1.6(PD1/OSC_OUT) X1.3
PA0: R5.2 SW4.1 U1.10(PA0/WKUP)
PA2: CN1.1 U1.12(PA2)
PA3: CN1.2 U1.13(PA3)
PA8: R14.1 U1.29(PA8)
PA9: R13.1 U1.30(PA9)
PA10: R12.1 U1.31(PA10)
PA11: CN1.5 U1.32(PA11)
PA12: CN1.6 U1.33(PA12)
PA13: CN1.3 U1.34(PA13)
PA14: CN1.4 U1.37(PA14)
PA15: H4.5 U1.38(PA15)
PB2: R7.2 U1.20(PB2)
PB3: H4.6 U1.39(PB3)
PB4: SW3.1 U1.40(PB4)
PB5: SW2.1 U1.41(PB5)
PB6: H1.3 U1.42(PB6)
PB7: H1.4 U1.43(PB7)
PB10: CN1.8 U1.21(PB10)
PB11: CN1.7 U1.22(PB11)
PB12: H4.1 U1.25(PB12)
PB13: H4.3 U1.26(PB13)
PB14: H4.2 U1.27(PB14)
PB15: H4.4 U1.28(PB15)
PC13: LED2.1(K) U1.2(PC13/TAMPER-RTC)
PC14: LED3.1(K) U1.3(PC14/OSC32_IN)
SW: C2.2 L1.1 U2.6(SW)
VREF: R23.2 R24.1 U8.1(REF) U9.1(REF)
$1N6913: LED1.2(A) R11.2
$2N1251: D4.2(A) Q1.1(G) R15.2
$2N1356: D7.2(A) Q4.1(G) R18.2
$2N1706: D5.2(A) Q2.1(G) R16.2
$2N1723: D8.2(A) Q5.1(G) R19.2
$2N1987: D6.2(A) Q3.1(G) R17.2
$2N2004: D9.2(A) Q6.1(G) R20.2
Net-(LED2-2): LED2.2(A) R25.2
Net-(LED3-2): LED3.2(A) R26.2

Not connected (* = marked no-connect by the designer): SW1 2* 3*; SW2 2* 3*; SW3 2* 3*; SW4 2* 3*; SW5 2* 3*; U1 4(PC15/OSC32_OUT)* 11(PA1)* 14(PA4)* 15(PA5)* 18(PB0)* 19(PB1)*; U4 5(VREF)*

## Notes on the sheets
sheet 1
- POWER 5V TO 3V3
- FOR VDD/VBAT
- FOR VREF
- AT32F415CBT7
- (optional)
- CAN
- CONN/DEBUG
- EEPROM
